# Altium schematic sheet TP-EVALBOARD.SchDoc: Trackpad sensor evaluation board
size 594 x 420 mm; Author: T. Ludemann; SheetNumber: 1; SheetTotal: 1; DocSize: DINA2; DevStatus: In Test
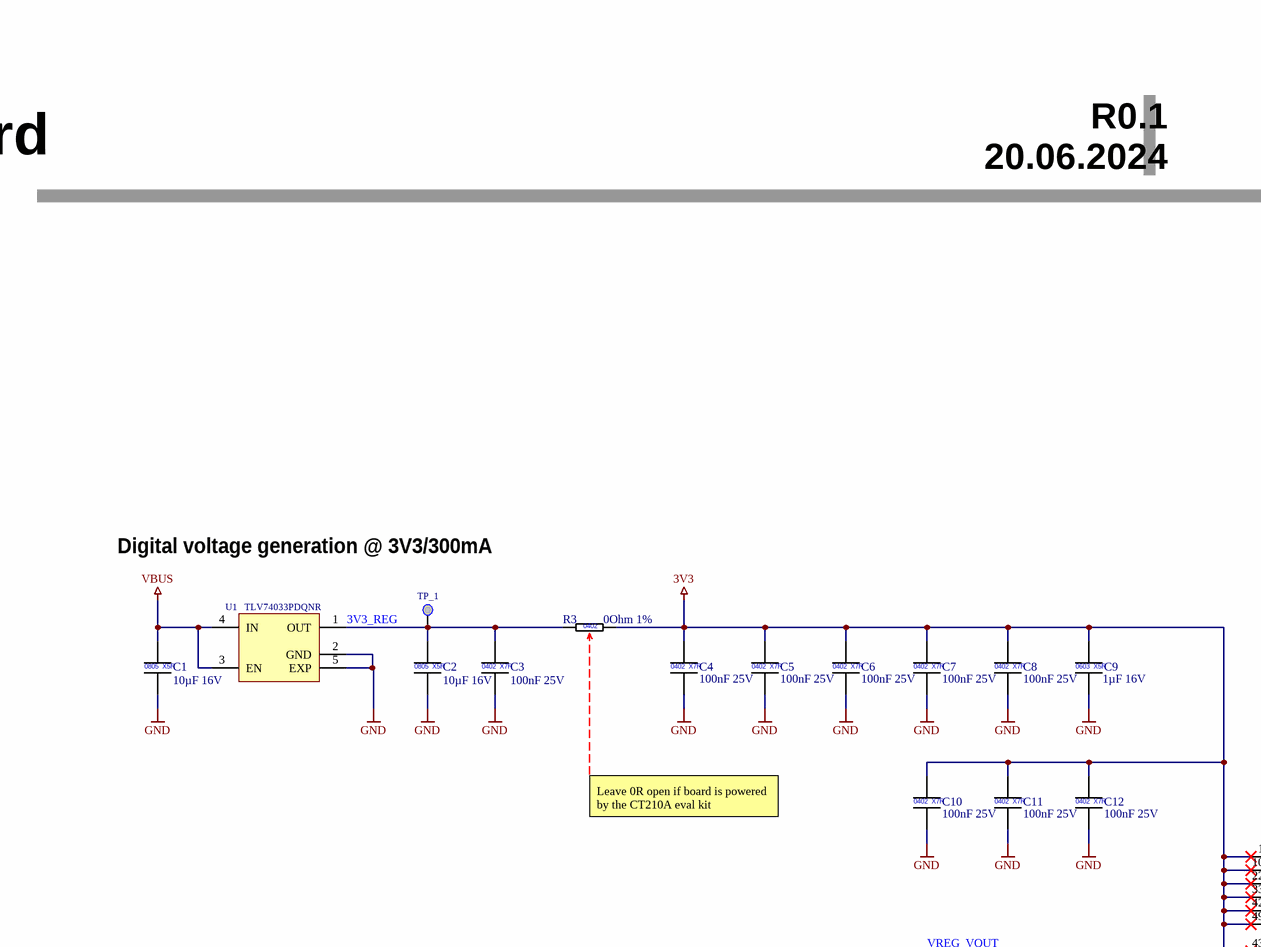
[diagram p0: TP-EVALBOARD.SchDoc, top left]
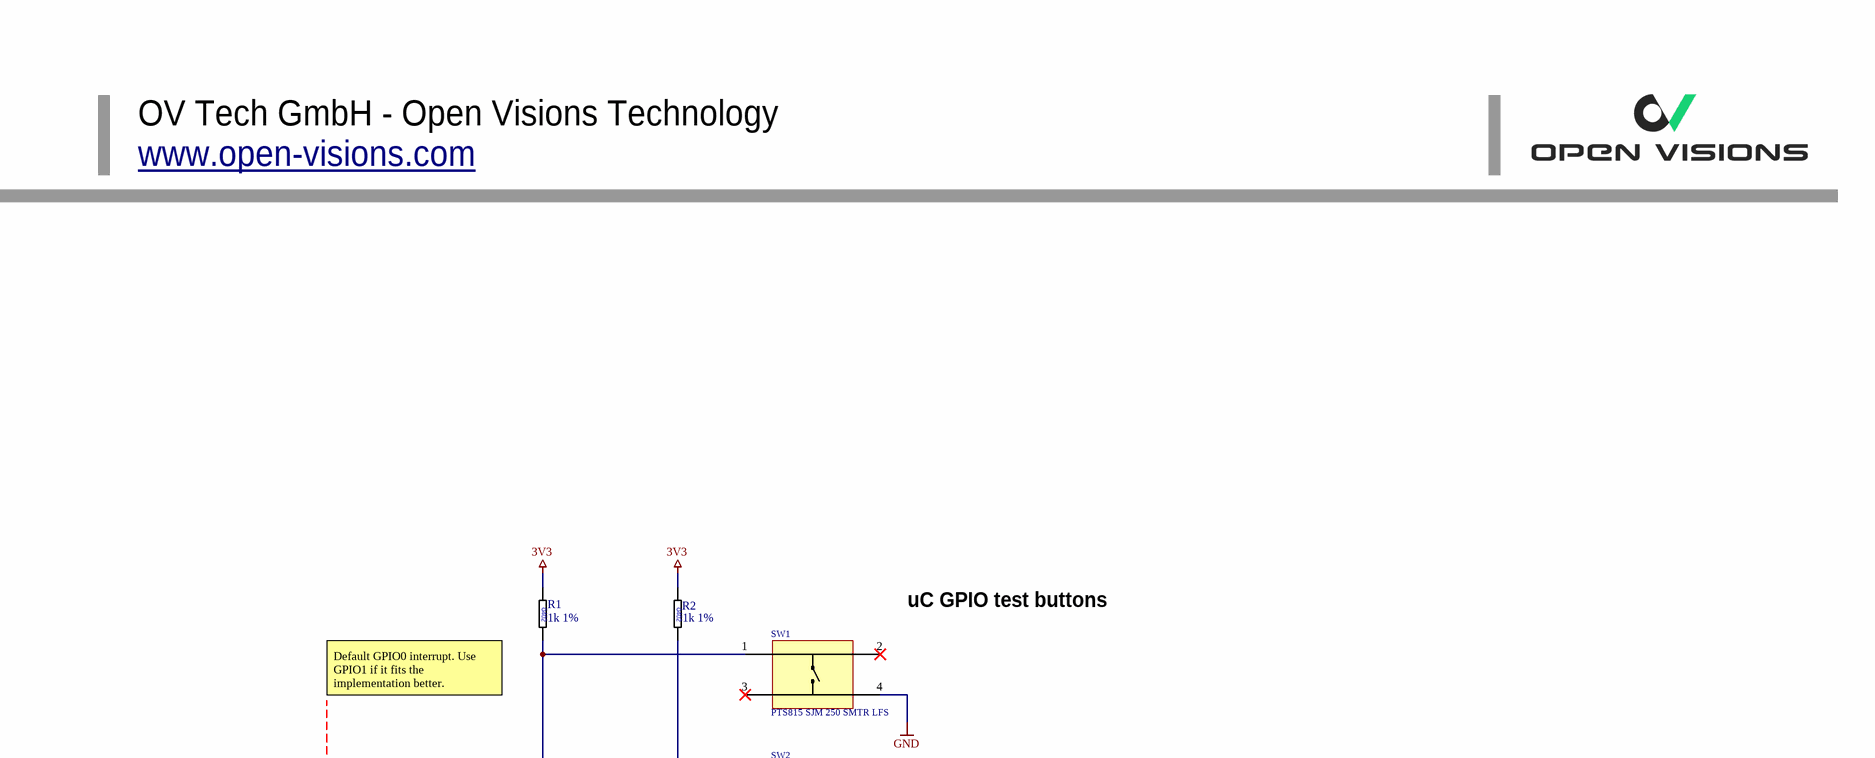
[diagram p1: TP-EVALBOARD.SchDoc, top right]
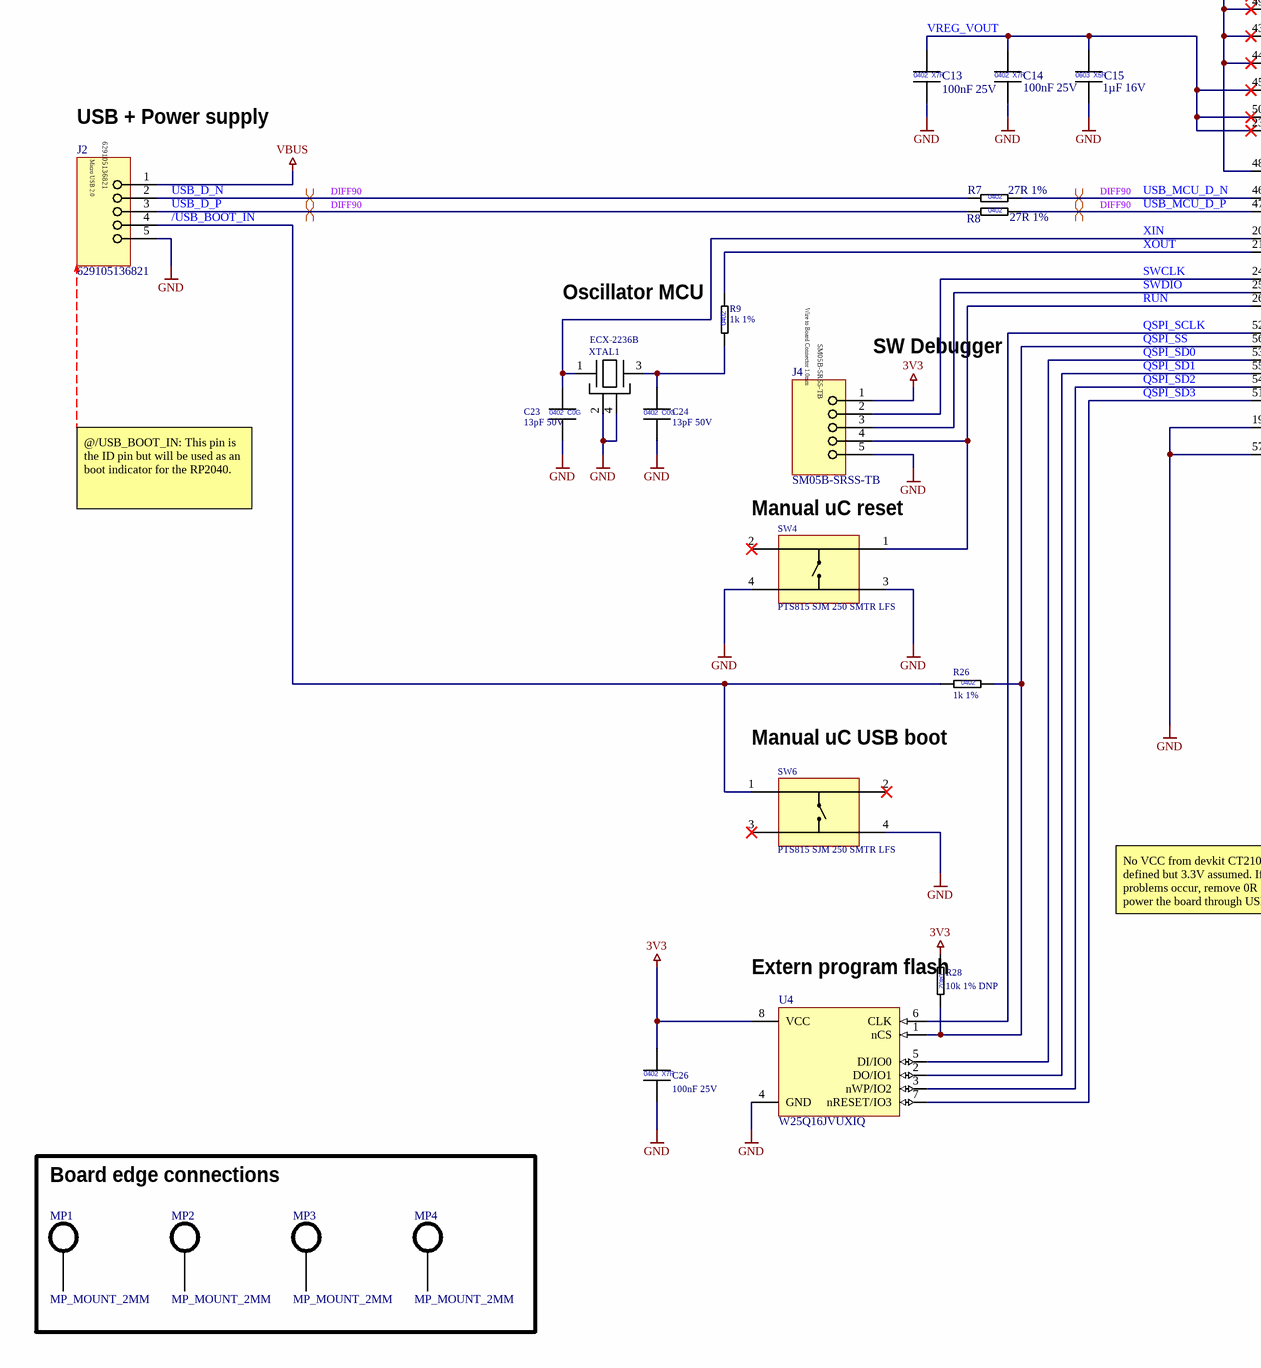
[diagram p2: TP-EVALBOARD.SchDoc, bottom left]
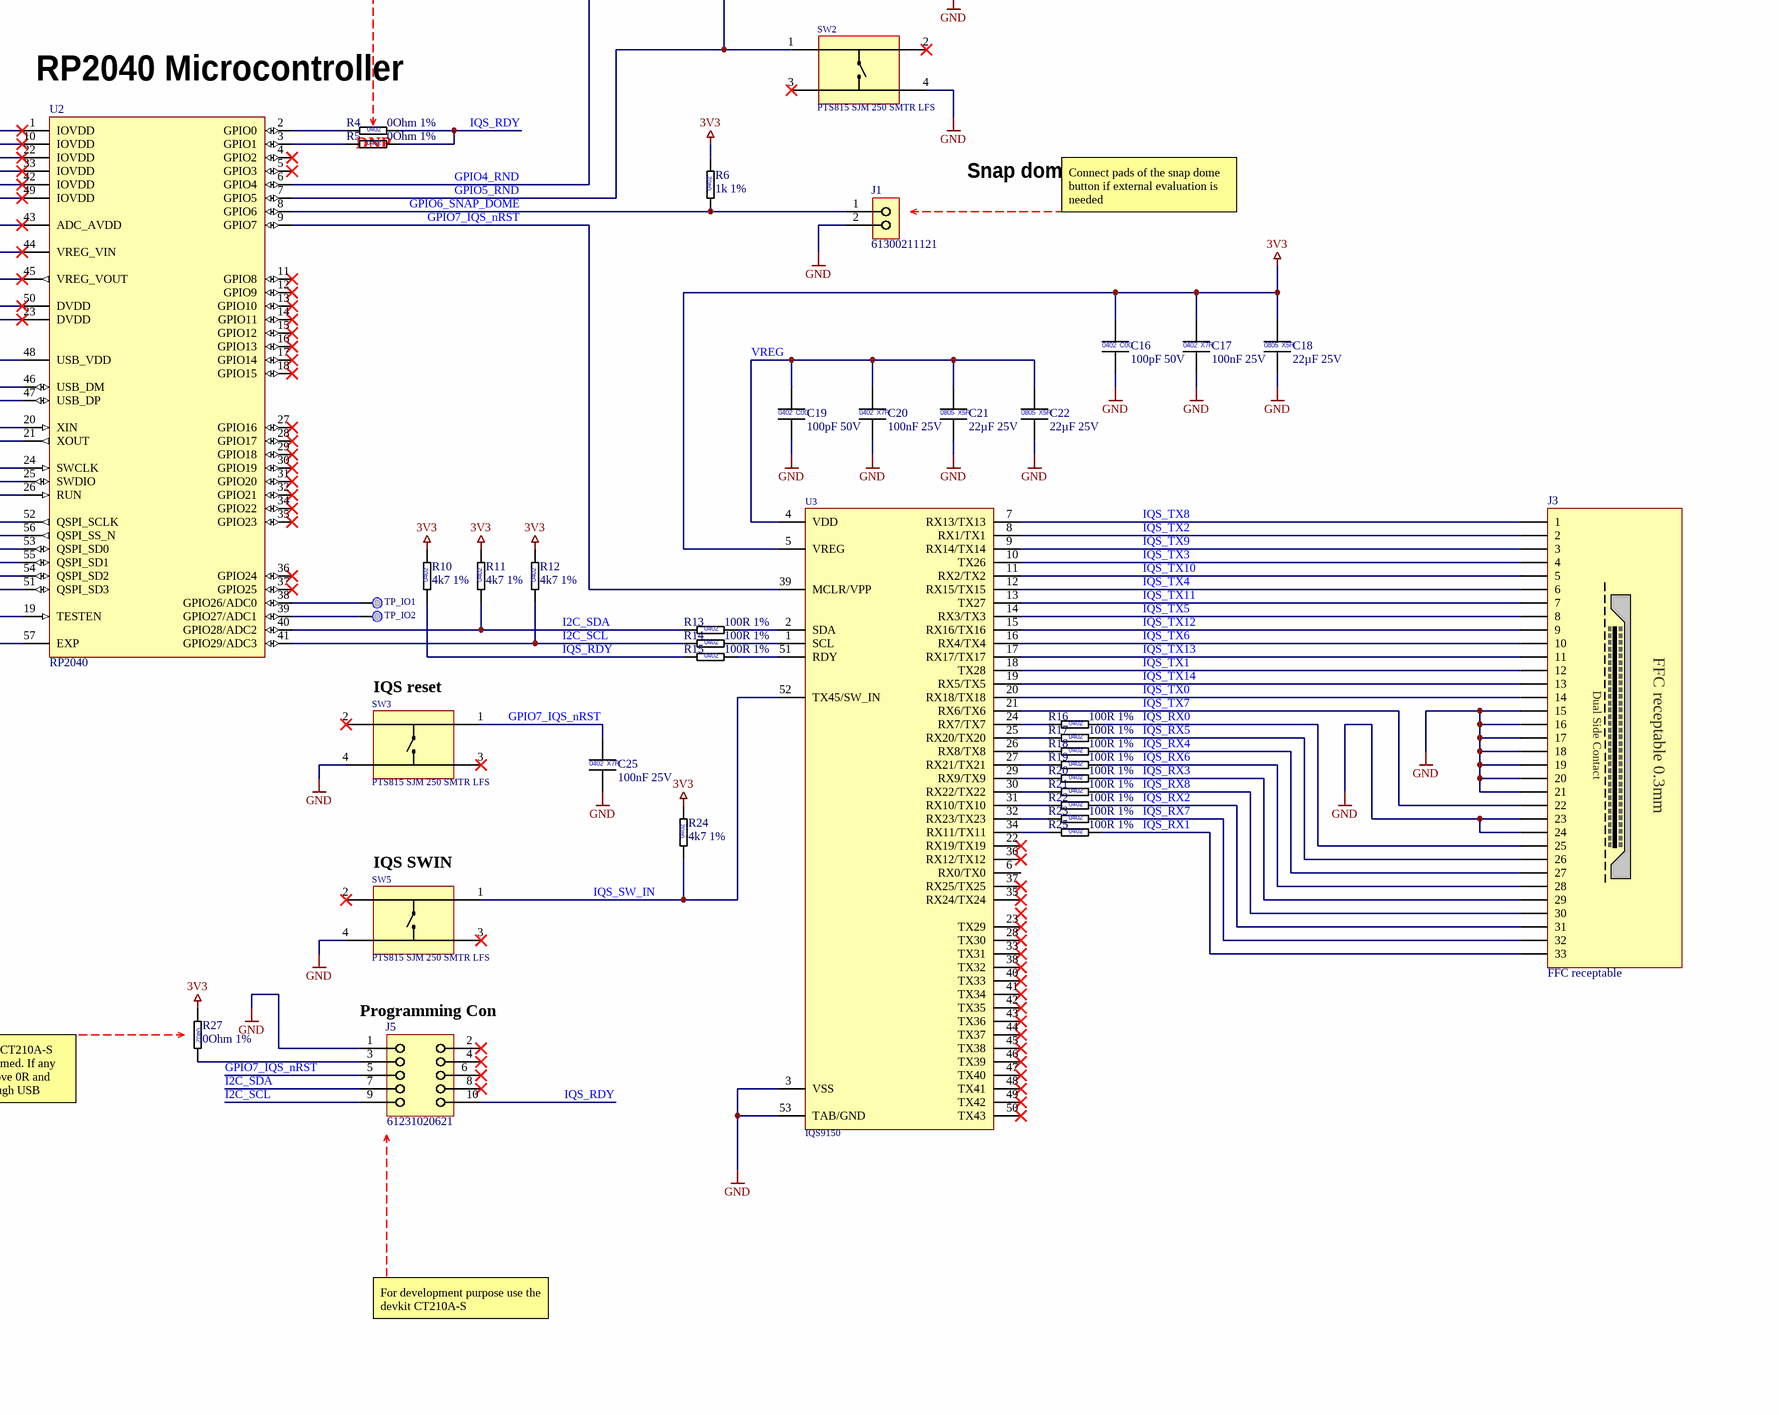
[diagram p3: TP-EVALBOARD.SchDoc, bottom right]

## Parts
?  (no value)  (graphical)
C1  10µF 16V  [CAPC2012X14L]
C2  10µF 16V  [CAPC2012X14L]
C3  100nF 25V  [CAPC1005X06L]
C4  100nF 25V  [CAPC1005X06L]
C5  100nF 25V  [CAPC1005X06L]
C6  100nF 25V  [CAPC1005X06L]
C7  100nF 25V  [CAPC1005X06L]
C8  100nF 25V  [CAPC1005X06L]
C9  1µF 16V  [CAPC1608X10L]
C10  100nF 25V  [CAPC1005X06L]
C11  100nF 25V  [CAPC1005X06L]
C12  100nF 25V  [CAPC1005X06L]
C13  100nF 25V  [CAPC1005X06L]
C14  100nF 25V  [CAPC1005X06L]
C15  1µF 16V  [CAPC1608X10L]
C16  100pF 50V  [CAPC1005X06L]
C17  100nF 25V  [CAPC1005X06L]
C18  22µF 25V  [CAPC2012X14L]
C19  100pF 50V  [CAPC1005X06L]
C20  100nF 25V  [CAPC1005X06L]
C21  22µF 25V  [CAPC2012X14L]
C22  22µF 25V  [CAPC2012X14L]
C23  13pF 50V  [CAPC1005X06L]
C24  13pF 50V  [CAPC1005X06L]
C25  100nF 25V  [CAPC1005X06L]
C26  100nF 25V  [CAPC1005X06L]
J1  61300211121  [Pin Header 2Pol 61300211121]
J2  629105136821  [USB-TYPE MICRO B_629105136821]
J3  FFC receptable  [WIRE-TO-BOARD_Receptable_FH35C-33S-0.3SHW(50)]  (no BOM)
J4  SM05B-SRSS-TB  [Wire-to-Board SM05B-SRSS-TB]
J5  61231020621  [WIRE-TO-BOARD_WE_61231020621]
MP1  MP_MOUNT_2MM  [MP_2MM]  (no BOM)
MP2  MP_MOUNT_2MM  [MP_2MM]  (no BOM)
MP3  MP_MOUNT_2MM  [MP_2MM]  (no BOM)
MP4  MP_MOUNT_2MM  [MP_2MM]  (no BOM)
R1  1k 1%  [RESC1005X04L]
R2  1k 1%  [RESC1005X04L]
R3  0Ohm 1%  [RESC1005X04L]
R4  0Ohm 1%  [RESC1005X04L]
R5  0Ohm 1%  [RESC1005X04L]
R6  1k 1%  [RESC1005X04L]
R7  27R 1%  [RESC1005X04L]
R8  27R 1%  [RESC1005X04L]
R9  1k 1%  [RESC1005X04L]
R10  4k7 1%  [RESC1005X04L]
R11  4k7 1%  [RESC1005X04L]
R12  4k7 1%  [RESC1005X04L]
R13  100R 1%  [RESC1005X04L]
R14  100R 1%  [RESC1005X04L]
R15  100R 1%  [RESC1005X04L]
R16  100R 1%  [RESC1005X04L]
R17  100R 1%  [RESC1005X04L]
R18  100R 1%  [RESC1005X04L]
R19  100R 1%  [RESC1005X04L]
R20  100R 1%  [RESC1005X04L]
R21  100R 1%  [RESC1005X04L]
R22  100R 1%  [RESC1005X04L]
R23  100R 1%  [RESC1005X04L]
R24  4k7 1%  [RESC1005X04L]
R25  100R 1%  [RESC1005X04L]
R26  1k 1%  [RESC1005X04L]
R27  0Ohm 1%  [RESC1005X04L]
R28  10k 1% DNP  [RESC1005X04L]
SW1  PTS815 SJM 250 SMTR LFS  [SW_TACT_PTS815 SJM 250 SMTR LFS]
SW2  PTS815 SJM 250 SMTR LFS  [SW_TACT_PTS815 SJM 250 SMTR LFS]
SW3  PTS815 SJM 250 SMTR LFS  [SW_TACT_PTS815 SJM 250 SMTR LFS]
SW4  PTS815 SJM 250 SMTR LFS  [SW_TACT_PTS815 SJM 250 SMTR LFS]
SW5  PTS815 SJM 250 SMTR LFS  [SW_TACT_PTS815 SJM 250 SMTR LFS]
SW6  PTS815 SJM 250 SMTR LFS  [SW_TACT_PTS815 SJM 250 SMTR LFS]
TP_1  Testpoint 0.75mm  [TP_0.75mm]  (value not drawn)  (no BOM)
TP_IO1  Testpoint 0.75mm  [TP_0.75mm]  (value not drawn)  (no BOM)
TP_IO2  Testpoint 0.75mm  [TP_0.75mm]  (value not drawn)  (no BOM)
U1  TLV74033PDQNR  [X2SON-DFN]
U2  RP2040  [QFN40P700X700X90_HS-57L]
U3  IQS9150  [QFN40P600X600X80_HS-53M]
U4  W25Q16JVUXIQ  [QFN50P300X200X60_HS-9L]
XTAL1  ECX-2236B  [XTAL_ECX-2236B2_250X200X60]

## Blocks framed on the sheet
Board edge connections: MP1-MP4

## Nets
3V3: C4.1 C5.1 C6.1 C7.1 C8.1 C9.1 C10.1 C11.1 C12.1 C16.1 C17.1 C18.1 C26.1 J4.1 R1.1 R2.1 R3.2 R6.2 R10.2 R11.2 R12.2 R24.2 R27.1 R28.1 U2.1(IOVDD) U2.10(IOVDD) U2.22(IOVDD) U2.33(IOVDD) U2.42(IOVDD) U2.43(ADC_AVDD) U2.44(VREG_VIN) U2.48(USB_VDD) U2.49(IOVDD) U3.5(VREG) U4.8(VCC)
GND: C1.2 C2.2 C3.2 C4.2 C5.2 C6.2 C7.2 C8.2 C9.2 C10.2 C11.2 C12.2 C13.2 C14.2 C15.2 C16.2 C17.2 C18.2 C19.2 C20.2 C21.2 C22.2 C23.2 C24.2 C25.2 C26.2 J1.2 J2.5 J3.15 J3.16 J3.17 J3.18 J3.19 J3.20 J3.21 J3.23 J3.24 J4.5 J5.1 SW1.4 SW2.4 SW3.4 SW4.3 SW4.4 SW5.4 SW6.4 U1.2(GND) U1.5(EXP) U2.19(TESTEN) U2.57(EXP) U3.3(VSS) U3.53(TAB/GND) U4.4(GND) XTAL1.2 XTAL1.4
VBUS: C1.1 J2.1 U1.3(EN) U1.4(IN)
3V3_REG: C2.1 C3.1 R3.1 TP_1.TP U1.1(OUT)
/USB_BOOT_IN: J2.4 R26.1 SW6.1
GPIO4_RND: R1.2 SW1.1 U2.6(GPIO4)
GPIO5_RND: R2.2 SW2.1 U2.7(GPIO5)
GPIO6_SNAP_DOME: J1.1 R6.1 U2.8(GPIO6)
GPIO7_IQS_nRST: C25.1 J5.5 SW3.1 U2.9(GPIO7) U3.39(MCLR/VPP)
I2C_SCL: J5.9 R12.1 R14.1 U2.41(GPIO29/ADC3)
I2C_SDA: J5.7 R11.1 R13.1 U2.40(GPIO28/ADC2)
IQS_RDY: J5.10 R4.2 R5.2 R10.1 R15.1
IQS_RX0: J3.25 R16.2
IQS_RX1: J3.33 R25.2
IQS_RX2: J3.31 R22.2
IQS_RX3: J3.29 R20.2
IQS_RX4: J3.27 R18.2
IQS_RX5: J3.26 R17.2
IQS_RX6: J3.28 R19.2
IQS_RX7: J3.32 R23.2
IQS_RX8: J3.30 R21.2
IQS_SW_IN: R24.1 SW5.1 U3.52(TX45/SW_IN)
IQS_TX0: J3.14 U3.20(RX18/TX18)
IQS_TX1: J3.12 U3.18(TX28)
IQS_TX2: J3.2 U3.8(RX1/TX1)
IQS_TX3: J3.4 U3.10(TX26)
IQS_TX4: J3.6 U3.12(RX15/TX15)
IQS_TX5: J3.8 U3.14(RX3/TX3)
IQS_TX6: J3.10 U3.16(RX4/TX4)
IQS_TX7: J3.22 U3.21(RX6/TX6)
IQS_TX8: J3.1 U3.7(RX13/TX13)
IQS_TX9: J3.3 U3.9(RX14/TX14)
IQS_TX10: J3.5 U3.11(RX2/TX2)
IQS_TX11: J3.7 U3.13(TX27)
IQS_TX12: J3.9 U3.15(RX16/TX16)
IQS_TX13: J3.11 U3.17(RX17/TX17)
IQS_TX14: J3.13 U3.19(RX5/TX5)
QSPI_SCLK: U2.52(QSPI_SCLK) U4.6(CLK)
QSPI_SD0: U2.53(QSPI_SD0) U4.5(DI/IO0)
QSPI_SD1: U2.55(QSPI_SD1) U4.2(DO/IO1)
QSPI_SD2: U2.54(QSPI_SD2) U4.3(nWP/IO2)
QSPI_SD3: U2.51(QSPI_SD3) U4.7(nRESET/IO3)
QSPI_SS: R26.2 R28.2 U2.56(QSPI_SS_N) U4.1(nCS)
RUN: J4.4 SW4.1 U2.26(RUN)
SWCLK: J4.2 U2.24(SWCLK)
SWDIO: J4.3 U2.25(SWDIO)
USB_D_N: J2.2 R7.1
USB_D_P: J2.3 R8.1
USB_MCU_D_N: R7.2 U2.46(USB_DM)
USB_MCU_D_P: R8.2 U2.47(USB_DP)
VREG: C19.1 C20.1 C21.1 C22.1 U3.4(VDD)
VREG_VOUT: C13.1 C14.1 C15.1 U2.23(DVDD) U2.45(VREG_VOUT) U2.50(DVDD)
XIN: C23.1 U2.20(XIN) XTAL1.1
XOUT: R9.2 U2.21(XOUT)
NetC24_1: C24.1 R9.1 XTAL1.3
NetJ5_3: J5.3 R27.2
NetR4_1: R4.1 U2.2(GPIO0)
NetR5_1: R5.1 U2.3(GPIO1)
NetR13_2: R13.2 U3.2(SDA)
NetR14_2: R14.2 U3.1(SCL)
NetR15_2: R15.2 U3.51(RDY)
NetR16_1: R16.1 U3.24(RX7/TX7)
NetR17_1: R17.1 U3.25(RX20/TX20)
NetR18_1: R18.1 U3.26(RX8/TX8)
NetR19_1: R19.1 U3.27(RX21/TX21)
NetR20_1: R20.1 U3.29(RX9/TX9)
NetR21_1: R21.1 U3.30(RX22/TX22)
NetR22_1: R22.1 U3.31(RX10/TX10)
NetR23_1: R23.1 U3.32(RX23/TX23)
NetR25_1: R25.1 U3.34(RX11/TX11)
NetTP_IO1_TP: TP_IO1.TP U2.38(GPIO26/ADC0)
NetTP_IO2_TP: TP_IO2.TP U2.39(GPIO27/ADC1)

Not connected (* = marked no-connect by the designer): J5 2* 4* 6 8*; MP1 1; MP2 1; MP3 1; MP4 1; SW1 2* 3(1)*; SW2 2* 3(1)*; SW3 2* 3(1)*; SW4 2*; SW5 2* 3(1)*; SW6 2* 3(1)*; U2 4(GPIO2)* 5(GPIO3)* 11(GPIO8)* 12(GPIO9)* 13(GPIO10)* 14(GPIO11)* 15(GPIO12)* 16(GPIO13)* 17(GPIO14)* 18(GPIO15)* 27(GPIO16)* 28(GPIO17)* 29(GPIO18)* 30(GPIO19)* 31(GPIO20)* 32(GPIO21)* 34(GPIO22)* 35(GPIO23)* 36(GPIO24)* 37(GPIO25)*; U3 6(RX0/TX0) 22(RX19/TX19)* 23(TX29)* 28(TX30)* 33(TX31)* 35(RX24/TX24)* 36(RX12/TX12)* 37(RX25/TX25)* 38(TX32)* 40(TX33)* 41(TX34)* 42(TX35)* 43(TX36)* 44(TX37)* 45(TX38)* 46(TX39)* 47(TX40)* 48(TX41)* 49(TX42)* 50(TX43)*

## Layout directives
differential pair; differential pair class DIFF90: USB_D_N, USB_D_P, USB_MCU_D_N, USB_MCU_D_P

## Notes on the sheet
- Trackpad sensor evaluation board
- R0.1
- 20.06.2024
- OV Tech GmbH - Open Visions Technology
- www.open-visions.com <http://www.open-visions.com>
- Digital voltage generation @ 3V3/300mA
- (near R2) uC GPIO test buttons
- (near R1) Default GPIO0 interrupt. Use GPIO1 if it fits the implementation better.
- Leave 0R open if board is powered by the CT210A eval kit
- RP2040 Microcontroller
- DNP
- Snap dome RND button
- Connect pads of the snap dome button if external evaluation is needed
- USB + Power supply
- (near R9) Oscillator MCU
- SW Debugger
- @/USB_BOOT_IN: This pin is the ID pin but will be used as an boot indicator for the RP2040.
- Manual uC reset
- (near SW3) IQS reset
- (near SW5) IQS SWIN
- Manual uC USB boot
- (near J5) Programming Con
- No VCC from devkit CT210A-S defined but 3.3V assumed. If any problems occur, remove 0R and power the board through USB
- (near R28) Extern program flash
- For development purpose use the devkit CT210A-S
- (in symbol CAP_0402_13pF_50V) 0402; C0G
- (in symbol CAP_0402_100nF_25V) 0402; X7R
- (in symbol CAP_0402_100pF_50V) 0402; C0G
- (in symbol CAP_0603_1µ_16V) 0603; X5R
- (in symbol CAP_0805_10µ_16V) 0805; X5R
- (in symbol CAP_0805_22µ_25V) 0805; X5R
- (in symbol FFC Receptable_33pol_FH35C-33S-0.3SHW) FFC receptable 0.3mm; Dual Side Contact
- (in symbol RES_0402_0R_1%) 0402
- (in symbol RES_0402_1k_1%) 0402
- (in symbol RES_0402_4k7_1%) 0402
- (in symbol RES_0402_10k_1%) 0402
- (in symbol RES_0402_27R_1%) 0402
- (in symbol RES_0402_100R_1%) 0402
- (in symbol USB Type Micro USB Connector_629105136821) Micro USB 2.0
- (in symbol Wire to Board Connector_5pol_SM05B-SRSS-TB) Wire to Board Connector 1.0mm

## Library data of the parts
? = Titleblock_01_OpenSource
C1 C2 = CAP_0805_10µ_16V: Multilayer Ceramic Capacitors MLCC - SMD/SMT 0603 25VDC; Manufacturer 1: Samsung Electro-Mechanics; Manufacturer 1 Prt. Nr.: CL21A106KOQNNNG; Manufacturer 2 Prt. Nr.: C0805C106K8PAC7210; Manufacturer 2: KEMET
C3-C8 C10-C14 C17 C20 C25 C26 = CAP_0402_100nF_25V: Multilayer Ceramic Capacitors MLCC - SMD/SMT 0402 25VDC; Manufacturer 1: KYOCERA AVX; Manufacturer 1 Prt. Nr.: KGM05AR71C104KH; Manufacturer 2 Prt. Nr.: EMK105B7104KV-F; Manufacturer 2: Taiyo Yuden
C9 C15 = CAP_0603_1µ_16V: Multilayer Ceramic Capacitors MLCC - SMD/SMT 0603 16VDC; Manufacturer 1: Samsung Electro-Mechanics; Manufacturer 1 Prt. Nr.: CL05A105KO5NNNC; Manufacturer 2 Prt. Nr.: EMK105BJ105KV-F; Manufacturer 2: Taiyo Yuden
C16 C19 = CAP_0402_100pF_50V: Multilayer Ceramic Capacitors MLCC - SMD/SMT 0402 50VDC; Manufacturer 1: Murata Electronics; Manufacturer 1 Prt. Nr.: GRT1555C1H101JA02D; Manufacturer 2 Prt. Nr.: CC0402JPNPO9BN101; Manufacturer 2: YAGEO
C18 C21 C22 = CAP_0805_22µ_25V: Multilayer Ceramic Capacitors MLCC - SMD/SMT 0603 25VDC; Manufacturer 1: Murata Electronics; Manufacturer 1 Prt. Nr.: GRM21BR61E226ME44K; Manufacturer 2 Prt. Nr.: CC0805MKX5R8BB226; Manufacturer 2: YAGEO
C23 C24 = CAP_0402_13pF_50V: Multilayer Ceramic Capacitors MLCC - SMD/SMT 0402 50VDC; Manufacturer 1: Murata Electronics; Manufacturer 1 Prt. Nr.: GRT1555C1H130FA02D; Manufacturer 2 Prt. Nr.: CQ0402FRNPO9BN130; Manufacturer 2: YAGEO
J1 = Pin Header_2pol_61300211121: Pin Header 2 Pol 2.54mm; Manufacturer 1: Würth elektronik; Manufacturer 1 Prt. Nr.: 61300211121
J2 = USB Type Micro USB Connector_629105136821: WR-COM Micro USB 2.0 SMT Type B Horizontal 5 Contacts; Manufacturer 1: Würth Elektronik; Manufacturer Part Number1: 629105136821
J3 = FFC Receptable_33pol_FH35C-33S-0.3SHW: Manufacturer 1: N/A; Manufacturer 1 Prt. Nr.: N/A
J4 = Wire to Board Connector_5pol_SM05B-SRSS-TB: Wire to Board Connector 5pol 1.0mm Pitch; Manufacturer 1: JST; Manufacturer 1 Prt. Nr.: SM05B-SRSS-TB
J5 = Wire to Board Connector_10pol_61231020621: Wire to Board Connector 10pol 2.54mm Pitch; Manufacturer 1: Würth Elektronik; Manufacturer 1 Prt. Nr.: 61231020621
MP1-MP4 = MP_MOUNT_2MM: Mounting hole with 1 mm radius
R1 R2 R6 R9 R26 = RES_0402_1k_1%: Thick Film Resistors - SMD 1k 1%; Manufacturer 1: Vishay / Dale; Manufacturer 1 Prt. Nr.: CRCW04021K00FKEDC; Manufacturer 2 Prt. Nr.: RT0402FRE131KL; Manufacturer 2: YAGEO
R3-R5 R27 = RES_0402_0R_1%: Thick Film Resistors - SMD 0OHM 1%; Manufacturer 1: Bourns; Manufacturer 1 Prt. Nr.: CR0402AJ/-000GAS; Manufacturer 2 Prt. Nr.: AC0402FR-070RL; Manufacturer 2: YAGEO
R7 R8 = RES_0402_27R_1%: Thick Film Resistors - SMD 27R 1%; Manufacturer 1: YAGEO; Manufacturer 1 Prt. Nr.: RC0402FR-0727RL; Manufacturer 2 Prt. Nr.: CRGCQ0402F27R; Manufacturer 2: TE Connectivity Passive Product
R10-R12 R24 = RES_0402_4k7_1%: Thick Film Resistors - SMD 4.7k 1%; Manufacturer 1: Vishay / Dale; Manufacturer 1 Prt. Nr.: CRCW04024K70FKEDC; Manufacturer 2 Prt. Nr.: ERJ-PA2F4701X; Manufacturer 2: Panasonic
R13-R23 R25 = RES_0402_100R_1%: Thick Film Resistors - SMD 100R 1%; Manufacturer 1: Vishay / Dale; Manufacturer 1 Prt. Nr.: CRCW0402100RFKEDC; Manufacturer 2 Prt. Nr.: RC0402FR-07100RL; Manufacturer 2: YAGEO
R28 = RES_0402_10k_1%: Thick Film Resistors - SMD 10k 1%; Manufacturer 1: Vishay / Dale; Manufacturer 1 Prt. Nr.: CRCW040210K0FKEDC; Manufacturer 2 Prt. Nr.: RT0402FRE0710KL; Manufacturer 2: YAGEO
SW1-SW6 = SW_TACTILE_PTS815 SJM 250 SMTR LFS: SMD Switch Tactile SMD 4,20mm x 3,20mm; Manufacturer 1: C&K; Manufacturer 1 Prt. Nr.: PTS815 SJM 250 SMTR LFS
U1 = LDO 3.3V_TLV74033PDQNR: LDO voltage regulator 300mA X2SON; Manufacturer 1: Texas Instruments; Manufacturer 1 Prt. Nr.: TLV74033PDQNR
U2 = uC_32bit_30IO_RP2040_Rev2: 32Bit Microcontroller 30IO 133MHz RP2040; Manufacturer 1: Raspberry Pi Foundation; Manufacturer 1 Prt. Nr.: RP2040
U3 = Touch Controller_IQS9150-000QFR: Projected capacitive trackpad/touchscreen controller with proximity, touch, snap, trackpad / outputs and gestures.; Manufacturer 1: Azoteq; Manufacturer 1 Prt. Nr.: IQS9150-000QFR
U4 = NOR_Flash_W25Q16JVUXIQ_Rev2: NOR Flash spiFlash, 3V, 16M-bit, 4Kb Uniform Sector, DTR; Manufacturer 1: Winbond; Manufacturer 1 Prt. Nr.: W25Q16JVUXIQ
XTAL1 = Crystal_ECX-2236B_12MHz: SMD Crystal 12 MHz 10pF; Manufacturer 1: ECS; Manufacturer 1 Prt. Nr.: ECS-120-10-36B-CWY-TR3; Temperature Range: -30°C-85°C